# Altium schematic sheet Input_Power.SchDoc
size A; SheetNumber: 1; SheetTotal: 3
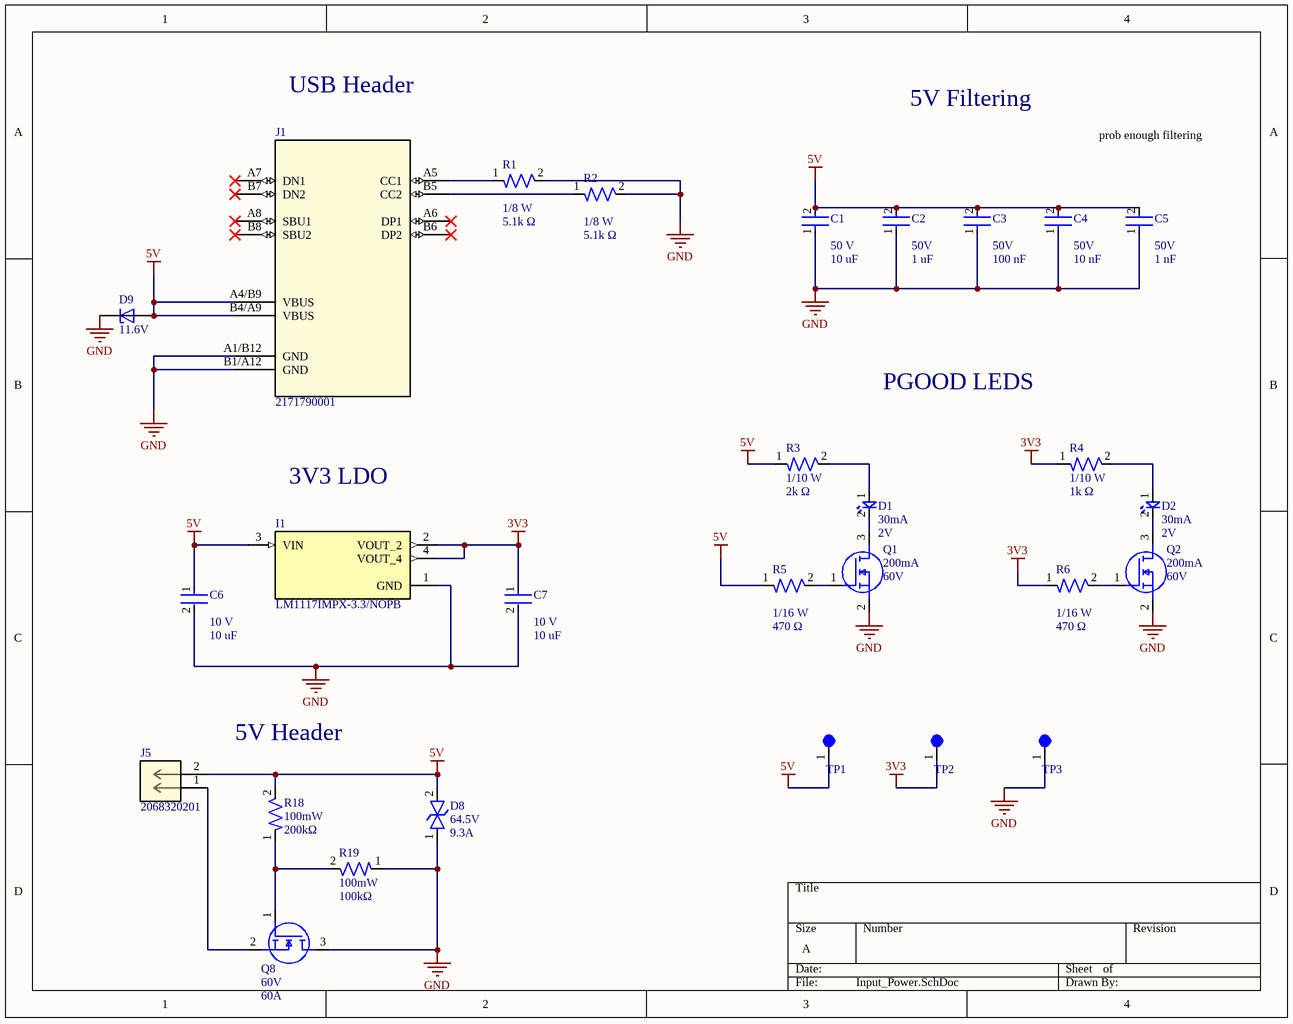
[diagram p0: Input_Power.SchDoc]

## Parts
C1  Voltage Rating: 50 V  Capacitance: 10 uF  [CAP-1210]  (hidden comment: CL32B106KBJNNWE)
C2  Voltage Rating: 50V  Capacitance: 1 uF  [CAP-0805]  (hidden comment: CC0805KKX7R9BB105)
C3  Voltage Rating: 50V  Capacitance: 100 nF  [CAP-0805]  (hidden comment: CC0805KRX7R9BB104)
C4  Voltage Rating: 50V  Capacitance: 10 nF  [CAP-0603]  (hidden comment: CC0603KPX7R9BB103)
C5  Voltage Rating: 50V  Capacitance: 1 nF  [CAP-0402]  (hidden comment: CC0402KRX7R9BB102)
C6  Voltage Rating: 10 V  Capacitance: 10 uF  [CAP-0603]  (hidden comment: GRM188R61A106MAALJ)
C7  Voltage Rating: 10 V  Capacitance: 10 uF  [CAP-0603]  (hidden comment: GRM188R61A106MAALJ)
D1  Forward Current: 30mA  Forward Voltage: 2V  [LED-0603]  (hidden comment: BL-HKC36G-AV-TRB)
D2  Forward Current: 30mA  Forward Voltage: 2V  [LED-0603]  (hidden comment: BL-HKC36G-AV-TRB)
D8  Voltage Rating: 64.5V  Current Rating: 9.3A  [DO-214AA (SMBJ)]  (hidden comment: SMBJ5.0A)
D9  Voltage: 11.6V  [TVS_ESDA7P60-1U1M]  (hidden comment: ESDA7P60-1U1M)
I1  LM1117IMPX-3.3/NOPB  [IC-SOT-223-4]
J1  2171790001  [2171790001_MOL]
J5  2068320201  [CONN_2068320000-SD_02_MOL]
Q1  Continuous Current: 200mA  Voltage: 60V  [IC-SOT23-3]  (hidden comment: T2N7002AK,LM)
Q2  Continuous Current: 200mA  Voltage: 60V  [IC-SOT23-3]  (hidden comment: T2N7002AK,LM)
Q8  Voltage: 60V  Continuous Current: 60A  [IC-8VSONCLIP]  (hidden comment: CSD18543Q3AT)
R1  Wattage: 1/8 W  Resistance: 5.1k Ω  [RES-0805]  (hidden comment: RC0805JR-075K1L)
R2  Wattage: 1/8 W  Resistance: 5.1k Ω  [RES-0805]  (hidden comment: RC0805JR-075K1L)
R3  Wattage: 1/10 W  Resistance: 2k Ω  [RES-0603]  (hidden comment: RC0603FR-072KL)
R4  Wattage: 1/10 W  Resistance: 1k Ω  [RES-0603]  (hidden comment: RT0603FRE131KL)
R5  Wattage: 1/16 W  Resistance: 470 Ω  [RES-0402]  (hidden comment: RC0402FR-07470RL)
R6  Wattage: 1/16 W  Resistance: 470 Ω  [RES-0402]  (hidden comment: RC0402FR-07470RL)
R18  Wattage: 100mW  Resistance: 200kΩ  [RES-0603]  (hidden comment: RC0603FR-07200KL)
R19  Wattage: 100mW  Resistance: 100kΩ  [RES-0603]  (hidden comment: RC0603FR-07100KL)
TP1  5003  [TEST-POINT-0001]  (value not drawn)
TP2  5003  [TEST-POINT-0001]  (value not drawn)
TP3  5003  [TEST-POINT-0001]  (value not drawn)

## Nets
3V3: C7.1 I1.2(VOUT_2) I1.4(VOUT_4) R4.1 R6.1 TP2.1
5V: C1.2 C2.2 C3.2 C4.2 C5.2 C6.1 D8.2 D9.2 I1.3(VIN) J1.A4/B9(VBUS) J1.B4/A9(VBUS) J5.2 R3.1 R5.1 R18.2 TP1.1
GND: C1.1 C2.1 C3.1 C4.1 C5.1 C6.2 C7.2 D8.1 D9.1 I1.1(GND) J1.A1/B12(GND) J1.B1/A12(GND) Q1.2(S) Q2.2(S) Q8.3(D) R1.2 R2.2 R19.1 TP3.1
NetD1_1: D1.1 R3.2
NetD1_2: D1.2 Q1.3(D)
NetD2_1: D2.1 R4.2
NetD2_2: D2.2 Q2.3(D)
NetJ1_A5: J1.A5(CC1) R1.1
NetJ1_B5: J1.B5(CC2) R2.1
NetJ5_1: J5.1 Q8.2(S)
NetQ1_1: Q1.1(G) R5.2
NetQ2_1: Q2.1(G) R6.2
NetQ8_1: Q8.1(G) R18.1 R19.2

Not connected (* = marked no-connect by the designer): J1 A6(DP1)* A7(DN1)* A8(SBU1)* B6(DP2)* B7(DN2)* B8(SBU2)*

## Notes on the sheet
- USB Header
- 5V Filtering
- prob enough filtering
- PGOOD LEDS
- 3V3 LDO
- 5V Header

## Library data of the parts
C1 = CAP 1210
C2 C3 = CAP 0805
C4 C6 C7 = CAP 0603
C5 = CAP 0402
D1 D2 = LED-0001: LED YELLOW CLEAR 0603 SMD; ComponentLink1Description: Datasheet; ComponentLink1URL: https://www.americanbrightled.com/pdffiles/led-components/smt/BL-HKC36G-AV-TRB.pdf
D8 = DIO-TVS-0001: TVS DIODE 40VWM 64.5VC DO214AA; ComponentLink1Description: Datasheet; ComponentLink1URL: https://www.littelfuse.com/media?resourcetype=datasheets&itemid=09a6ae9a-73cb-4ac4-acac-e6dab92ab953&filename=littelfuse_tvs_diode_smbj_datasheet.pdf
D9 = DIO-TVS-11V: TVS DIODE 5VWM 11.6VC 1610; MF: {'manufacturer': u'STMicroelectronics'}; Package: None; Price: None; Value: *; MP: ESDA7P60-1U1M; Availability: Unavailable; ComponentLink1Description: Datasheet; ComponentLink1URL: https://www.st.com/resource/en/datasheet/esda20p50-1u1m.pdf
I1 = IC_LDO_3V3_0001: IC REG LIN 3.3V 800MA SOT223-4; ComponentLink1Description: New link; ComponentLink1URL: https://www.ti.com/lit/ds/symlink/lm1117.pdf?HQS=dis-dk-null-digikeymode-dsf-pf-null-wwe&ts=1721700739746
J1 = 2171790001: Universal Serial Bus (USB) Shielded I/O Receptacle, Type C, Right-Angle, Top Mount, Surface Mount, Single Row, 16 Circuits, Gold (Au) Plating; Manufacturer_Name: Molex Connector Corporation; Copyright: Copyright (C) 2025 Ultra Librarian. All rights reserved.; Manufacturer_Part_Number: 2171790001; RefDes: RefDes; Type: Type
J5 = CONN MF+ 2 PIN VERT: Micro-Fit+ Vertical Header, Through Hole, 3.00mm Pitch, Dual Row, 2 Circuits, Tin (Sn) Plating, Glow-Wire Capable, Black, Tray; Manufacturer_Name: Molex Connector Corporation; Copyright: Copyright (C) 2025 Ultra Librarian. All rights reserved.; Manufacturer_Part_Number: 2068320201; RefDes: RefDes; Type: Type
Q1 Q2 = NMOS-200MA-0001: MOSFET N-CH 60V 200MA SOT23; ComponentLink1Description: Datasheet; ComponentLink1URL: https://toshiba.semicon-storage.com/info/T2N7002AK_datasheet_en_20150401.pdf?did=29712&prodName=T2N7002AK
Q8 = NMOS-60A-0001: MOSFET N-CH 60V 12A/60A 8VSON; ComponentLink2Description: Datasheet; ComponentLink2URL: http://www.ti.com/lit/ds/symlink/csd18543q3a.pdf
R1 R2 = RES 0805
R3 R4 R18 R19 = RES 0603
R5 R6 = RES 0402
TP1-TP3 = TEST-POINT-0001: Oranange PC Test Point, Miniature Phoisphor Bronze Silver Plating Through Hole Mounting Type